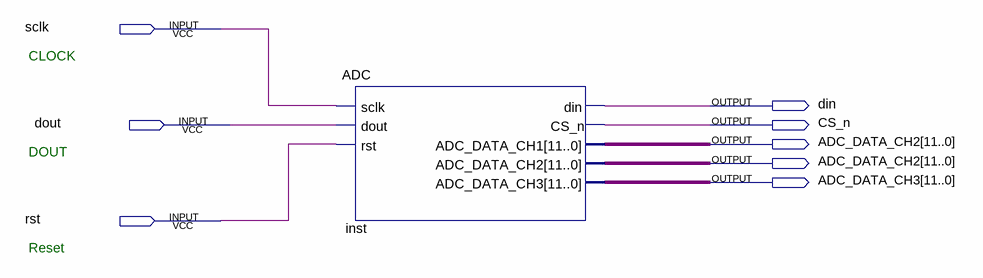
[diagram p0: schematic sheet]
// Quartus schematic ADC_Block.bdf as structural Verilog: 1 symbols, 8 pins
module ADC_Block (
  input  sclk,
  input  dout,
  input  rst,
  output din,
  output CS_n,
  output [11:0] ADC_DATA_CH2,
  output [11:0] ADC_DATA_CH3
);

  ADC inst (
    .sclk(sclk), .dout(dout), .rst(rst), .din(din), .CS_n(CS_n), .ADC_DATA_CH1(ADC_DATA_CH2),
    .ADC_DATA_CH2(ADC_DATA_CH2), .ADC_DATA_CH3(ADC_DATA_CH3));

  // Notes on the sheet:
  //   CLOCK
  //   DOUT
  //   Reset
endmodule
